# EAGLE design EMBEDDED (EAGLE 6.5.0)
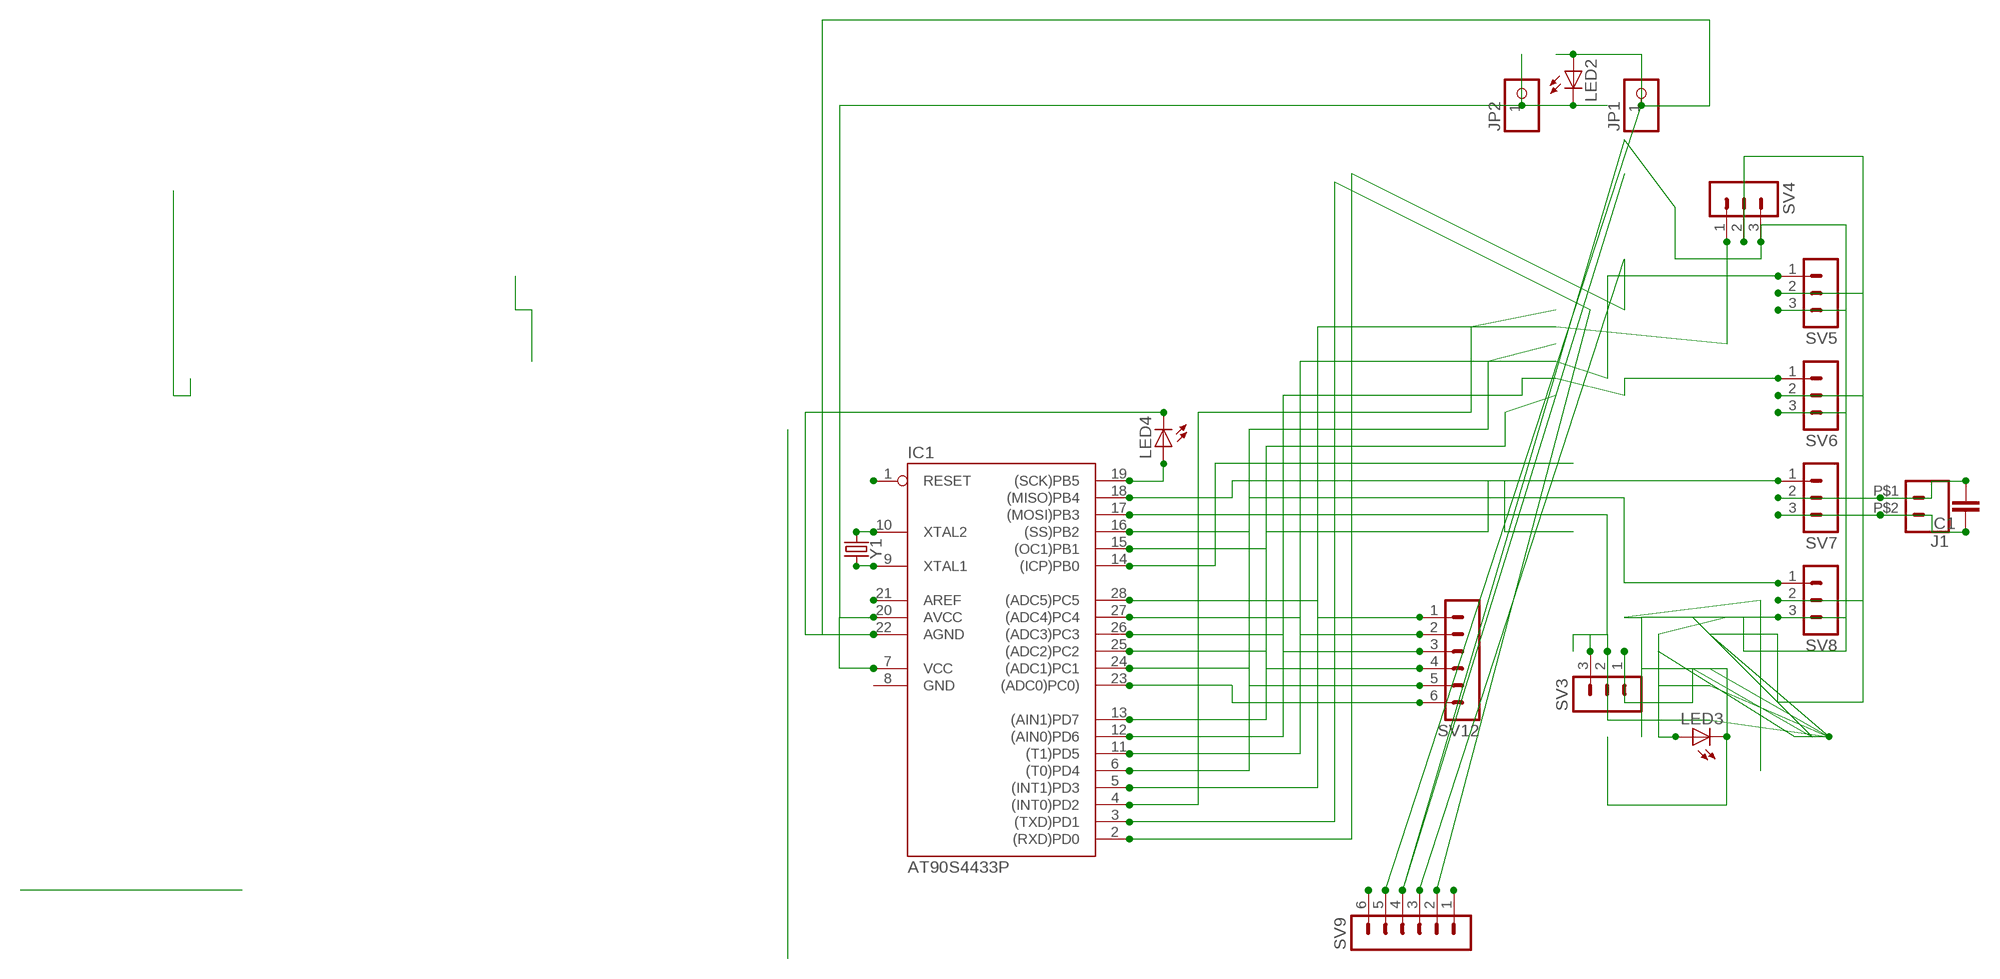
[diagram p0: schematic, sheet 1]

## Parts
C1  C5/2.5  [C5B2.5]
IC1  AT90S4433P  [DIL28-3]
J1  CONN_02PTH2  [1X02_BIG]
JP1  PINHD-1X1  [1X01]
JP2  PINHD-1X1  [1X01]
LED2  LEDLD260  [LD260]
LED3  LEDLD260  [LD260]
LED4  LEDLD260  [LD260]
SV3  MA03-1  [MA03-1]
SV4  MA03-1  [MA03-1]
SV5  MA03-1  [MA03-1]
SV6  MA03-1  [MA03-1]
SV7  MA03-1  [MA03-1]
SV8  MA03-1  [MA03-1]
SV9  MA06-1  [MA06-1]
SV12  MA06-1  [MA06-1]
Y1  CRYSTALPTH-HC49US  [HC49US]

## Nets
N$1: IC1.17((MOSI)PB3) SV3.3
N$2: C1.2 J1.P$1 LED3.A SV3.2 SV4.2 SV5.2 SV6.2 SV7.2 SV8.2
N$5: IC1.22(AGND) JP1.1 LED2.A LED4.K(C) SV9.5
N$6: IC1.7(VCC) IC1.20(AVCC) JP2.1 LED2.K(C)
N$10: IC1.16((SS)PB2) SV8.1
N$12: IC1.15((OC1)PB1) SV7.1
N$15: IC1.12((AIN0)PD6) SV6.1
N$18: IC1.28((ADC5)PC5) SV12.1
N$19: IC1.11((T1)PD5) SV5.1
N$20: IC1.21(AREF)
N$21: IC1.9(XTAL1) Y1.2
N$22: IC1.5((INT1)PD3) SV4.1
N$23: SV9.6
N$24: IC1.27((ADC4)PC4) SV12.2
N$25: IC1.26((ADC3)PC3) SV12.3
N$26: IC1.2((RXD)PD0) SV9.3
N$27: IC1.3((TXD)PD1) SV9.2
N$28: SV9.1
N$29: IC1.25((ADC2)PC2) SV12.4
N$30: IC1.24((ADC1)PC1) SV12.5
N$31: IC1.23((ADC0)PC0)) SV12.6
N$32: IC1.10(XTAL2) Y1.1
N$33: IC1.1(RESET)
N$35: IC1.4((INT0)PD2)
N$37: IC1.6((T0)PD4)
N$40: IC1.13((AIN1)PD7)
N$41: IC1.14((ICP)PB0)
N$46: IC1.18((MISO)PB4)
N$54: IC1.19((SCK)PB5) LED4.A
OMAR: C1.1 J1.P$2 LED3.K(C) SV3.1 SV4.3 SV5.3 SV6.3 SV7.3 SV8.3 SV9.4

## Power pins joined to a net without a drawn wire
GND: IC1.8(GND)

## Library data of the parts
C1 = capacitor-wima:C: CAPACITOR naming: grid - package width
IC1 = atmel:AT90S4433: MICROCONTROLLER 4 Kbytes FLASH 128 bytes SRAM 256 bytes EEPROM UART 6-channel 10 bit ADC; OC_FARNELL: unknown; OC_NEWARK: unknown
J1 = SparkFun-Connectors:CONN_02: Multi connection point. Often used as Generic Header-pin footprint for 0.1 inch spaced/style header connections On any of the 0.1 inch spaced packages, you can populate with these: Break Away Headers - Straight <https://www.sparkfun.com/products/116> (PRT-00116) Break Away Male Headers - Right Angle <https://www.sparkfun.com/products/553> (PRT-00553) Female Headers <https://www.sparkfun.com/products/115> (PRT-00115) Break Away Headers - Machine Pin <https://www.sparkfun.com/products/117> (PRT-00117) Break Away Female Headers - Swiss Machine Pin <https://www.sparkfun.com/products/743> (PRT-00743) For SCREWTERMINALS and SPRING TERMINALS visit here: Screw Terimnals on SparkFun.com <https://www.sparkfun.com/search/results?term=Screw+Terminals> (5mm/3.5mm/2.54mm spacing) This device is also useful as a general connection point to wire up your design to another part of your project. Our various solder wires solder well into these plated through hole pads. Hook-Up Wire - Assortment (Stranded, 22 AWG) <https://www.sparkfun.com/products/11375> (PRT-11375) Hook-Up Wire - Assortment (Solid Core, 22 AWG) <https://www.sparkfun.com/products/11367> (PRT-11367) View the entire wire category on our website here <https://www.sparkfun.com/categories/141> Special notes: Molex polarized connector foot print use with: PRT-08233 with associated crimp pins and housings. 2.54_SCREWTERM for use with PRT-10571. 3.5mm Screw Terminal footprints for PRT-08084 5mm Screw Terminal footprints for use with PRT-08432
JP1 JP2 = pinhead:PINHD-1X1: PIN HEADER
LED2-LED4 = led:LED: LED OSRAM: - CHIPLED LG R971, LG N971, LY N971, LG Q971, LY Q971, LO R971, LY R971 LH N974, LH R974 LS Q976, LO Q976, LY Q976 LO Q996 - Hyper CHIPLED LW Q18S LB Q993, LB Q99A, LB R99A - SideLED LS A670, LO A670, LY A670, LG A670, LP A670 LB A673, LV A673, LT A673, LW A673 LH A674 LY A675 LS A676, LA A676, LO A676, LY A676, LW A676 LS A679, LY A679, LG A679 - Hyper Micro SIDELED® LS Y876, LA Y876, LO Y876, LY Y876 LT Y87S - SmartLED LW L88C, LW L88S LB L89C, LB L89S, LG L890 LS L89K, LO L89K, LY L89K LS L896, LA L896, LO L896, LY L896 - TOPLED LS T670, LO T670, LY T670, LG T670, LP T670 LSG T670, LSP T670, LSY T670, LOP T670, LYG T670 LG T671, LOG T671, LSG T671 LB T673, LV T673, LT T673, LW T673 LH T674 LS T676, LA T676, LO T676, LY T676, LB T676, LH T676, LSB T676, LW T676 LB T67C, LV T67C, LT T67C, LS T67K, LO T67K, LY T67K, LW E67C LS E67B, LA E67B, LO E67B, LY E67B, LB E67C, LV E67C, LT E67C LW T67C LS T679, LY T679, LG T679 LS T770, LO T770, LY T770, LG T770, LP T770 LB T773, LV T773, LT T773, LW T773 LH T774 LS E675, LA E675, LY E675, LS T675 LS T776, LA T776, LO T776, LY T776, LB T776 LHGB T686 LT T68C, LB T68C - Hyper Mini TOPLED® LB M676 - Mini TOPLED Santana® LG M470 LS M47K, LO M47K, LY M47K Source: http://www.osram.convergy.de LUXEON: - LUMILED® LXK2-PW12-R00, LXK2-PW12-S00, LXK2-PW14-U00, LXK2-PW14-V00 LXK2-PM12-R00, LXK2-PM12-S00, LXK2-PM14-U00 LXK2-PE12-Q00, LXK2-PE12-R00, LXK2-PE12-S00, LXK2-PE14-T00, LXK2-PE14-U00 LXK2-PB12-K00, LXK2-PB12-L00, LXK2-PB12-M00, LXK2-PB14-N00, LXK2-PB14-P00, LXK2-PB14-Q00 LXK2-PR12-L00, LXK2-PR12-M00, LXK2-PR14-Q00, LXK2-PR14-R00 LXK2-PD12-Q00, LXK2-PD12-R00, LXK2-PD12-S00 LXK2-PH12-R00, LXK2-PH12-S00 LXK2-PL12-P00, LXK2-PL12-Q00, LXK2-PL12-R00 Source: www.luxeon.com KINGBRIGHT: KA-3528ASYC Source: www.kingbright.com
SV3-SV8 = con-lstb:MA03-1: PIN HEADER; OC_FARNELL: unknown; OC_NEWARK: unknown
SV9 SV12 = con-lstb:MA06-1: PIN HEADER; OC_FARNELL: unknown; OC_NEWARK: unknown
Y1 = SparkFun-Clocks:CRYSTAL: Crystals (Generic) These are passive quartz crystals, which can be used as a clock source for a microcontroller. Crystal's are two-terminal devices. They require external "load" capacitors to generate an oscillating signal.

## Board
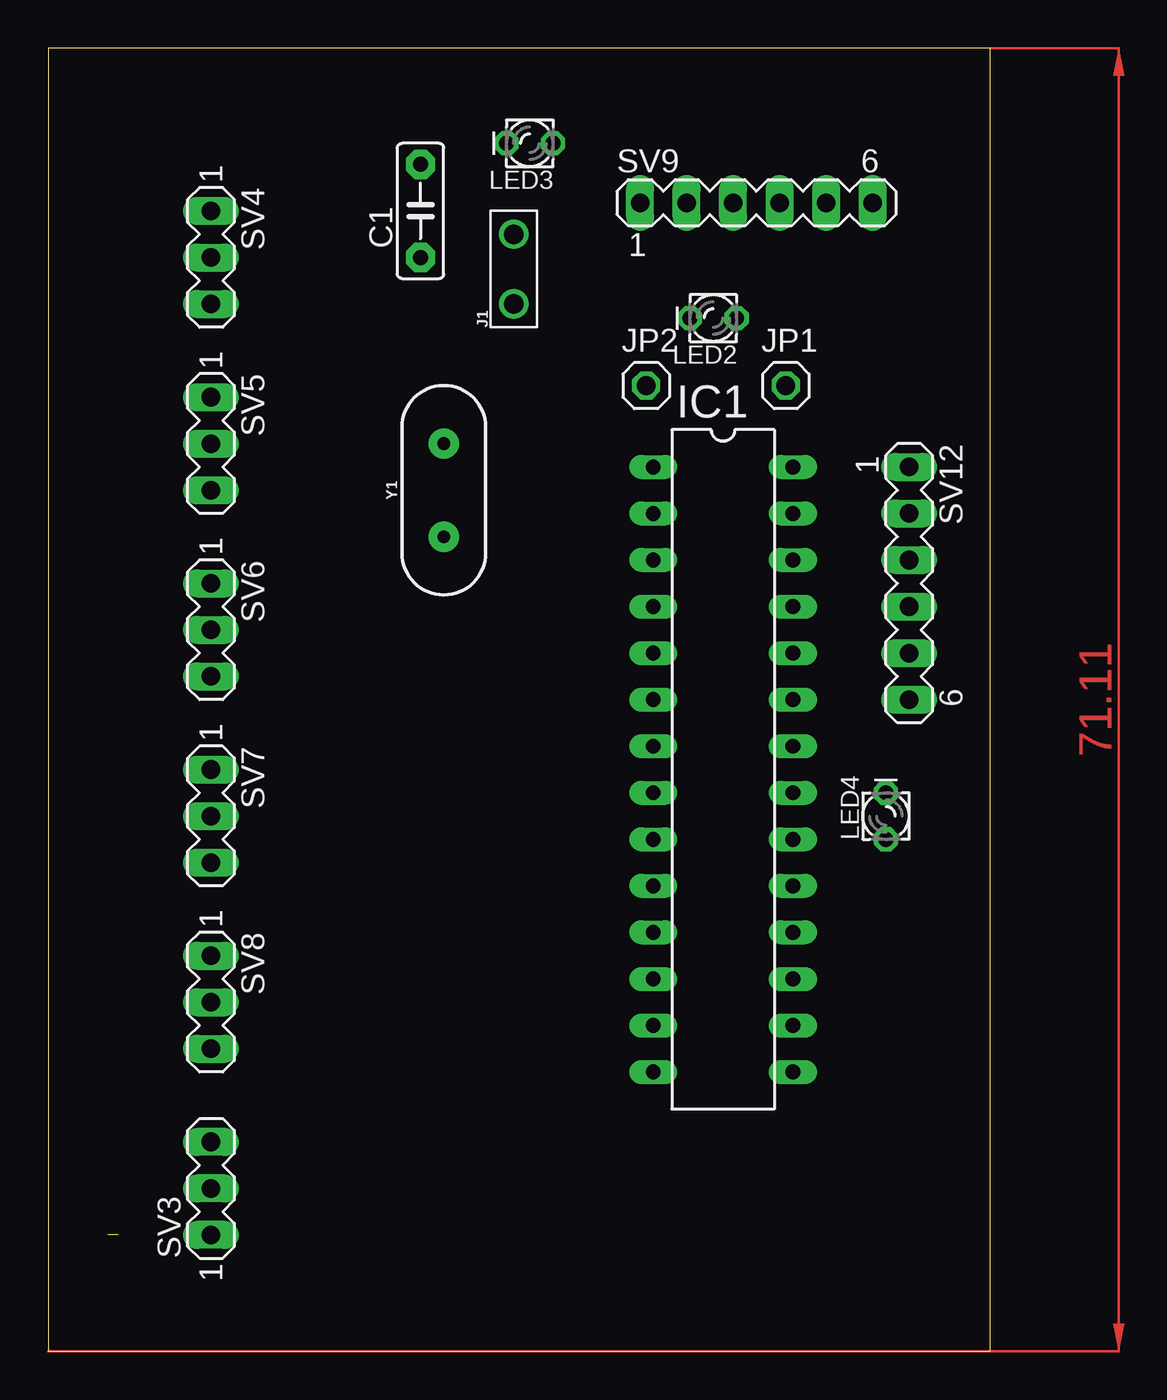
[diagram p1: board, top side]
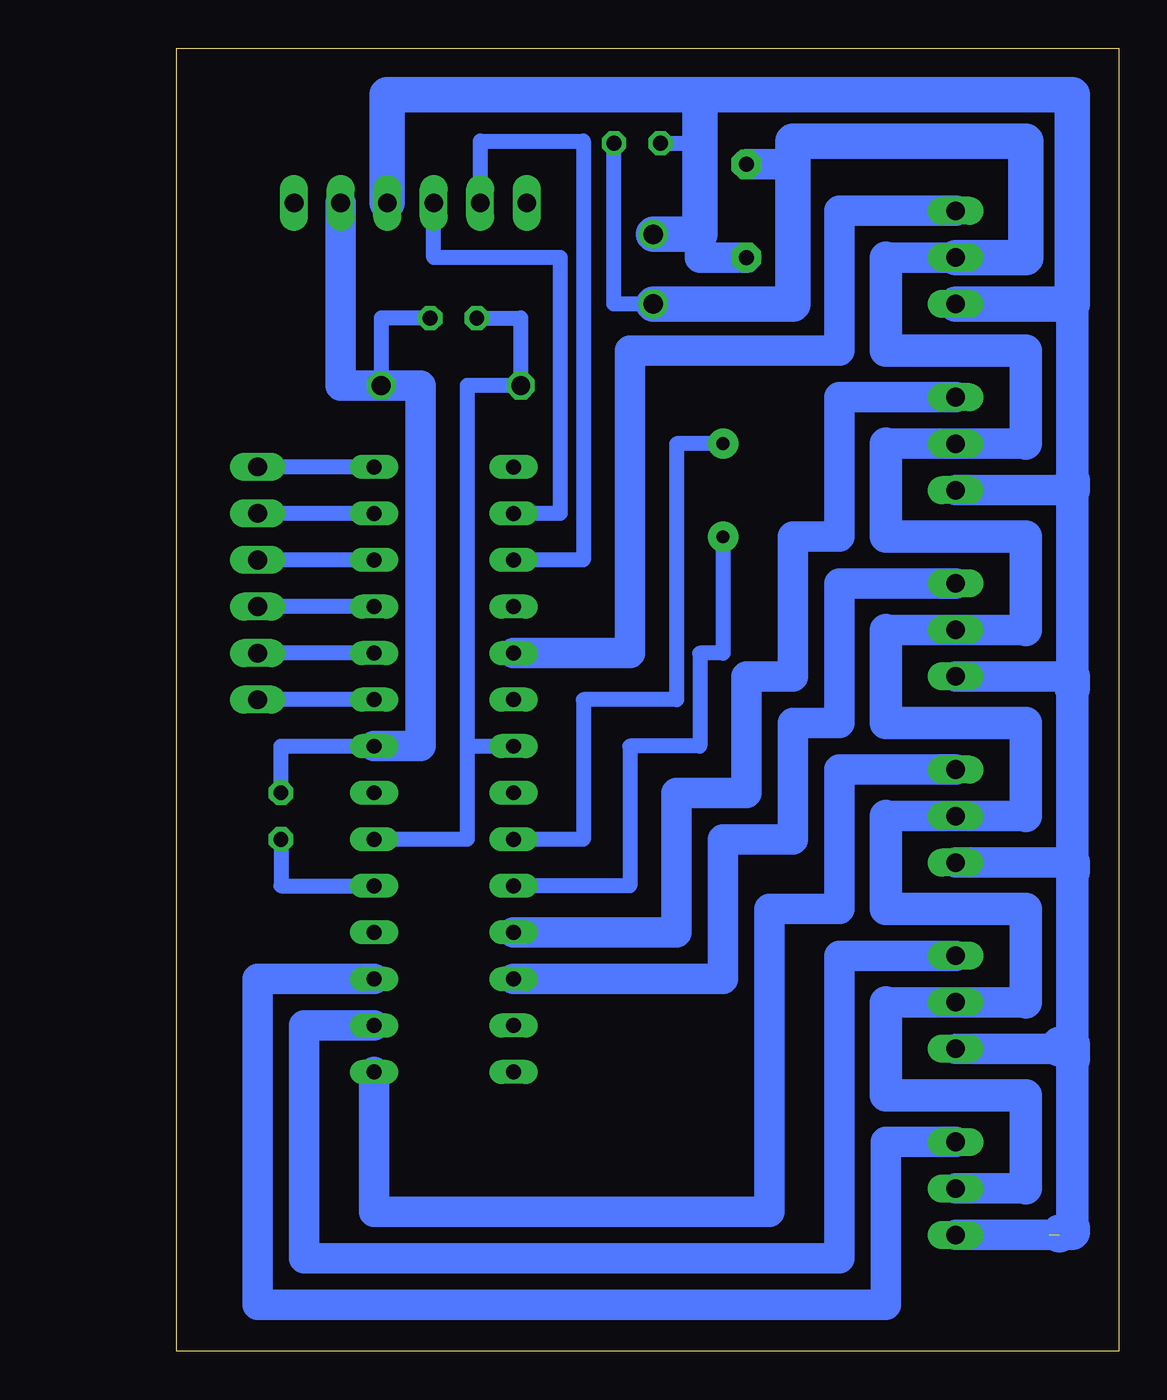
[diagram p2: board, bottom side, seen from below]

Size 51.41 x 71.11 mm. Coordinates in mm from the lower left corner, seen from the top.
Outline: 0,0 51.41,0 51.41,71.11 0,71.11 0,0
Copper layers (1*16): Top 0.035mm / dielectric 1.5mm / Bottom 0.035mm
Design rules "default": minimum track width 10mil, minimum drill 24mil, track to track 8mil, track to pad 8mil, pad to pad 8mil, via to via 8mil, smd to smd 8mil, copper to edge 40mil, drill to drill 8mil, minimum pad ring 10mil, minimum via ring 8mil, stop-mask expansion 4mil, vias tented up to drill 0mil, thermal gap 10mil

### Footprints (pad centres in the part's own frame; a part is rotated, then mirrored left to right if it is on the bottom)
C5B2.5 = drill 0.813 pad 1.6 octagon: 1 -2.54,0; 2 2.54,0
DIL28-3 = drill 0.813 long: 1 -16.51,-3.81; 2 -13.97,-3.81; 3 -11.43,-3.81; 4 -8.89,-3.81; 5 -6.35,-3.81; 6 -3.81,-3.81; 7 -1.27,-3.81; 8 1.27,-3.81; 9 3.81,-3.81; 10 6.35,-3.81; 11 8.89,-3.81; 12 11.43,-3.81; 13 13.97,-3.81; 14 16.51,-3.81; 15 16.51,3.81; 16 13.97,3.81; 17 11.43,3.81; 18 8.89,3.81; 19 6.35,3.81; 20 3.81,3.81; 21 1.27,3.81; 22 -1.27,3.81; 23 -3.81,3.81; 24 -6.35,3.81; 25 -8.89,3.81; 26 -11.43,3.81; 27 -13.97,3.81; 28 -16.51,3.81
1X02_BIG = drill 1.067: P$1 0,0; P$2 3.81,0
1X01 = drill 1.016 octagon: 1 0,0
LD260 = drill 0.813 octagon: A -1.27,0; K 1.27,0
MA03-1 = drill 1.016 long: 1 -2.54,0; 2 0,0; 3 2.54,0
MA06-1 = drill 1.016 long: 1 -6.35,0; 2 -3.81,0; 3 -1.27,0; 4 1.27,0; 5 3.81,0; 6 6.35,0
HC49US = drill 0.7 pad 1.651: 1 -2.54,0; 2 2.54,0

### Placement (x,y rotation side)
C1  20.32,62.23 90 top
IC1  36.83,31.75 270 top
J1  25.4,57.15 90 top
JP1  40.25,52.7 0 top
JP2  32.63,52.7 0 top
LED2  36.3,56.38 180 top
LED3  26.28,65.92 180 top
LED4  45.72,29.21 90 top
SV3  8.89,8.89 90 top
SV4  8.89,59.69 270 top
SV5  8.89,49.53 270 top
SV6  8.89,39.37 270 top
SV7  8.89,29.21 270 top
SV8  8.89,19.05 270 top
SV9  38.65,62.67 0 top
SV12  46.99,41.91 270 top
Y1  21.59,46.99 90 top

### Tracks (layer width: path | path; a pad name or v marks a point on that pad's centre or on a via)
N$1
  Bottom 1.676: SV3.3 12.7,11.43 12.7,2.54 46.99,2.54 46.99,20.32 IC1.17
N$2
  Bottom 0.813: J1.P$1 27.55,57.15 LED3.A
  Bottom 1.676: SV3.2 5.08,8.89 | 5.08,19.05 SV8.2 12.7,19.05 | 12.7,29.21 SV7.2 5.08,29.21 | 5.08,39.37 SV6.2 12.7,39.37 | 12.7,49.53 SV5.2 5.08,49.53 | SV4.2 12.7,59.69 | C1.2 17.78,64.77
  Bottom 1.778: 5.08,49.53 5.08,54.61 12.7,54.61 12.7,59.69 | 5.08,39.37 5.08,44.45 12.7,44.45 12.7,49.53 | 5.08,29.21 5.08,34.29 12.7,34.29 12.7,39.37 | 5.08,19.05 5.08,24.13 12.7,24.13 12.7,29.21 | 5.08,8.89 5.08,13.97 12.7,13.97 12.7,19.05
  Bottom 1.93: J1.P$1 17.78,57.15 17.78,64.77 17.78,66.04 5.08,66.04 5.08,59.69 SV4.2
N$5
  Bottom 0.813: LED2.A 40.25,56.38 JP1.1 | LED4.K 45.72,33.02 IC1.22
  Bottom 1.676: SV9.5 42.46,52.7 JP1.1 38.1,52.7 38.1,33.02 IC1.22
N$6
  Bottom 0.813: 35.56,33.02 35.56,52.7 JP2.1 32.63,56.38 LED2.K | 35.56,33.02 IC1.7 | 35.56,33.02 35.56,27.94 IC1.20
N$10
  Bottom 1.676: SV8.1 15.24,21.59 15.24,5.08 44.45,5.08 44.45,17.78 IC1.16
N$12
  Bottom 1.676: SV7.1 15.24,31.75 15.24,24.13 19.05,24.13 19.05,7.62 40.64,7.62 IC1.15
N$15
  Bottom 1.676: SV6.1 15.24,41.91 15.24,34.29 17.78,34.29 17.78,27.94 21.59,27.94 21.59,20.32 IC1.12
N$18
  Bottom 0.813: IC1.28 SV12.1
N$19
  Bottom 1.676: SV5.1 15.24,52.07 15.24,44.45 17.78,44.45 17.78,36.83 20.32,36.83 20.32,30.48 24.13,30.48 24.13,22.86 IC1.11
N$21
  Bottom 0.813: Y1.2 24.13,49.53 24.13,35.56 29.21,35.56 29.21,27.94 IC1.9
N$22
  Bottom 1.676: SV4.1 15.24,62.23 15.24,54.61 26.67,54.61 26.67,38.1 IC1.5
N$24
  Bottom 0.813: IC1.27 SV12.2
N$25
  Bottom 0.813: IC1.26 SV12.3
N$26
  Bottom 0.813: IC1.2 30.48,45.72 30.48,59.69 37.38,59.69 SV9.3
N$27
  Bottom 0.813: IC1.3 29.21,43.18 29.21,66.04 34.84,66.04 SV9.2
N$29
  Bottom 0.813: IC1.25 SV12.4
N$30
  Bottom 0.813: IC1.24 SV12.5
N$31
  Bottom 0.813: IC1.23 SV12.6
N$32
  Bottom 0.813: Y1.1 21.59,38.1 22.86,38.1 22.86,33.02 26.67,33.02 26.67,25.4 IC1.10
N$54
  Bottom 0.813: LED4.A 45.72,25.4 IC1.19
OMAR  (1 unrouted)
  Bottom 0.813: LED3.K 22.86,65.92 22.86,62.23
  Bottom 1.676: 2.54,57.15 2.54,56.97 2.97,56.97 2.97,57.15 SV4.3 | SV3.1 3.81,6.35 | SV8.3 2.54,16.51 | SV7.3 2.54,26.67 | SV6.3 2.54,36.83 | SV5.3 2.54,46.99 | C1.1 22.86,59.69 22.86,62.23
  Bottom 1.778: 2.54,47.52 2.54,56.97 | 2.54,6.75 2.54,15.93 | 2.54,16.51 2.54,26.19 | 2.54,26.67 2.54,36.18 | 2.54,36.83 2.54,46.99
  Bottom 1.93: 2.54,46.99 2.54,47.52 | 2.54,36.83 2.54,36.18 | 2.54,26.67 2.54,26.19 | 3.24,16.51 3.24,16.74 2.54,16.74 2.54,16.51 2.54,15.93 | 3.24,6.35 3.24,6.48 2.54,6.48 2.54,6.75 | SV4.3 2.54,57.15 2.54,68.58 22.86,68.58 | 22.86,68.58 39.92,68.58 SV9.4 | J1.P$2 22.86,60.96 22.86,62.23 22.86,68.58
(copper drawn outside any net)
  shapes: Top area x2